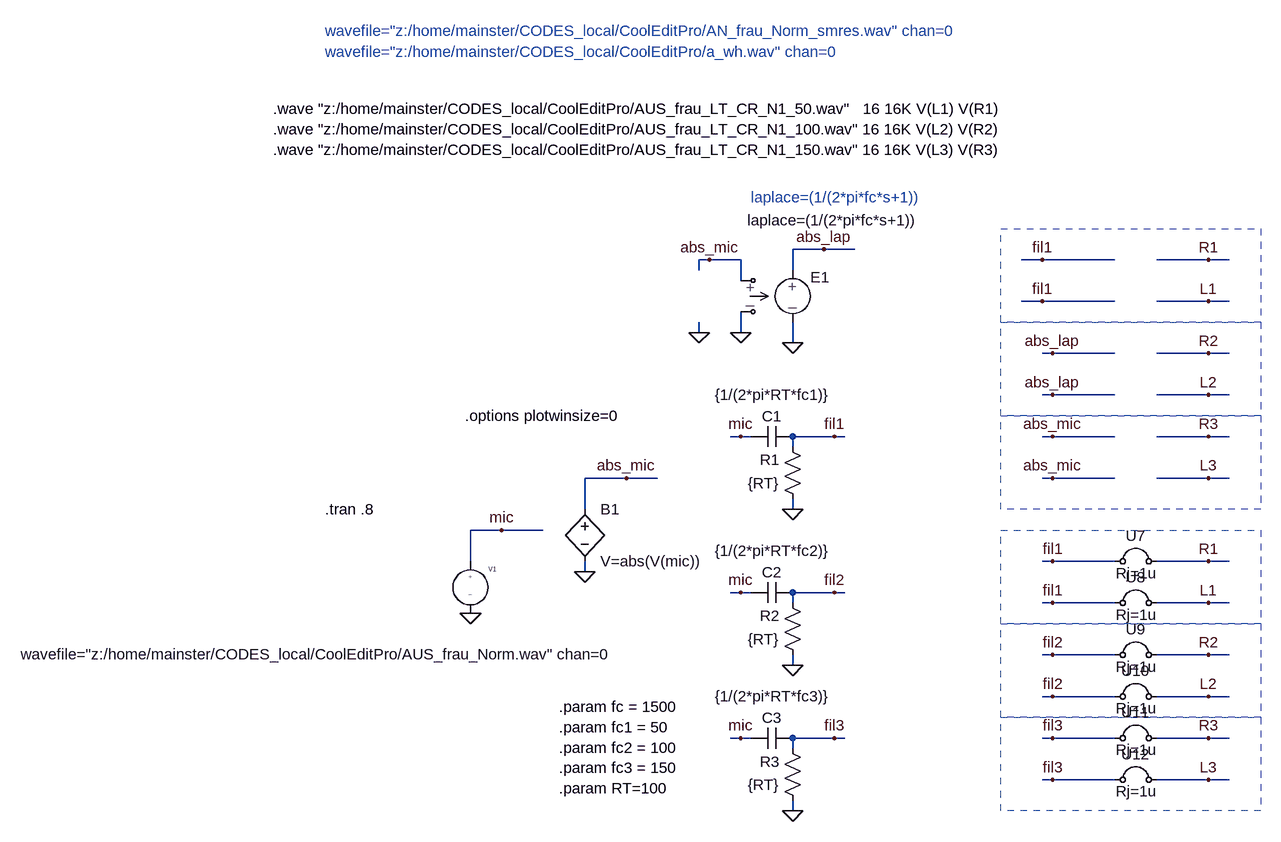
[diagram p0: schematic Grundton_entfernen.asc]
Grundton_entfernen.asc, the LTspice schematic file:
Version 4
SHEET 1 1932 680
WIRE 688 -368 640 -368
WIRE 736 -368 688 -368
WIRE 512 -352 496 -352
WIRE 560 -352 512 -352
WIRE 1024 -352 992 -352
WIRE 1136 -352 1024 -352
WIRE 1280 -352 1200 -352
WIRE 1312 -352 1280 -352
WIRE 496 -336 496 -352
WIRE 640 -336 640 -368
WIRE 560 -320 560 -352
WIRE 1024 -288 992 -288
WIRE 1136 -288 1024 -288
WIRE 1280 -288 1200 -288
WIRE 1312 -288 1280 -288
WIRE 496 -240 496 -256
WIRE 560 -240 560 -272
WIRE 640 -224 640 -256
WIRE 1040 -208 1024 -208
WIRE 1136 -208 1040 -208
WIRE 1280 -208 1200 -208
WIRE 1312 -208 1280 -208
WIRE 1040 -144 1024 -144
WIRE 1136 -144 1040 -144
WIRE 1280 -144 1200 -144
WIRE 1312 -144 1280 -144
WIRE 560 -80 544 -80
WIRE 576 -80 560 -80
WIRE 704 -80 640 -80
WIRE 720 -80 704 -80
WIRE 1040 -80 1024 -80
WIRE 1136 -80 1040 -80
WIRE 1280 -80 1200 -80
WIRE 1312 -80 1280 -80
WIRE 640 -64 640 -80
WIRE 384 -16 320 -16
WIRE 432 -16 384 -16
WIRE 1040 -16 1024 -16
WIRE 1136 -16 1040 -16
WIRE 1280 -16 1200 -16
WIRE 1312 -16 1280 -16
WIRE 320 32 320 -16
WIRE 640 32 640 16
WIRE 192 64 144 64
WIRE 256 64 192 64
WIRE 144 112 144 64
WIRE 1040 112 1024 112
WIRE 1136 112 1040 112
WIRE 1280 112 1200 112
WIRE 1312 112 1280 112
WIRE 320 128 320 112
WIRE 560 160 544 160
WIRE 576 160 560 160
WIRE 704 160 640 160
WIRE 720 160 704 160
WIRE 640 176 640 160
WIRE 1040 176 1024 176
WIRE 1136 176 1040 176
WIRE 1280 176 1200 176
WIRE 1312 176 1280 176
WIRE 1040 256 1024 256
WIRE 1136 256 1040 256
WIRE 1280 256 1200 256
WIRE 1312 256 1280 256
WIRE 640 272 640 256
WIRE 1040 320 1024 320
WIRE 1136 320 1040 320
WIRE 1280 320 1200 320
WIRE 1312 320 1280 320
WIRE 560 384 544 384
WIRE 576 384 560 384
WIRE 704 384 640 384
WIRE 720 384 704 384
WIRE 1040 384 1024 384
WIRE 1136 384 1040 384
WIRE 1280 384 1200 384
WIRE 1312 384 1280 384
WIRE 640 400 640 384
WIRE 1040 448 1024 448
WIRE 1136 448 1040 448
WIRE 1280 448 1200 448
WIRE 1312 448 1280 448
WIRE 640 496 640 480
FLAG 144 192 0
FLAG 192 64 mic
FLAG 320 128 0
FLAG 384 -16 abs_mic
FLAG 640 32 0
FLAG 704 -80 fil1
FLAG 560 -80 mic
FLAG 640 -224 0
FLAG 688 -368 abs_lap
FLAG 560 -240 0
FLAG 512 -352 abs_mic
FLAG 496 -240 0
FLAG 1280 112 R1
FLAG 1280 176 L1
FLAG 1280 256 R2
FLAG 1280 320 L2
FLAG 1280 384 R3
FLAG 1280 448 L3
FLAG 640 272 0
FLAG 704 160 fil2
FLAG 560 160 mic
FLAG 640 496 0
FLAG 704 384 fil3
FLAG 560 384 mic
FLAG 1280 -352 R1
FLAG 1280 -288 L1
FLAG 1280 -208 R2
FLAG 1280 -144 L2
FLAG 1280 -80 R3
FLAG 1280 -16 L3
FLAG 1040 -208 abs_lap
FLAG 1040 -144 abs_lap
FLAG 1040 -80 abs_mic
FLAG 1040 -16 abs_mic
FLAG 1040 112 fil1
FLAG 1040 176 fil1
FLAG 1040 256 fil2
FLAG 1040 320 fil2
FLAG 1040 384 fil3
FLAG 1040 448 fil3
FLAG 1024 -352 fil1
FLAG 1024 -288 fil1
SYMBOL source-V 144 96 R0
WINDOW 3 -692 159 Left 2
SYMATTR Value wavefile="z:/home/mainster/CODES_local/CoolEditPro/AUS_frau_Norm.wav" chan=0
SYMATTR InstName V1
SYMBOL bv 320 16 R0
SYMATTR InstName B1
SYMATTR Value V=abs(V(mic))
SYMBOL res 656 32 R180
WINDOW 0 36 76 Left 2
WINDOW 3 36 40 Left 2
SYMATTR InstName R1
SYMATTR Value {RT}
SYMBOL cap 640 -96 R90
WINDOW 0 0 32 VBottom 2
WINDOW 3 -33 31 VBottom 2
SYMATTR InstName C1
SYMATTR Value {1/(2*pi*RT*fc1)}
SYMBOL crtl-V-V 640 -352 R0
WINDOW 3 -70 -61 Left 2
SYMATTR Value laplace=(1/(2*pi*fc*s+1))
SYMATTR InstName E1
SYMBOL res 656 272 R180
WINDOW 0 36 76 Left 2
WINDOW 3 36 40 Left 2
SYMATTR InstName R2
SYMATTR Value {RT}
SYMBOL cap 640 144 R90
WINDOW 0 0 32 VBottom 2
WINDOW 3 -33 31 VBottom 2
SYMATTR InstName C2
SYMATTR Value {1/(2*pi*RT*fc2)}
SYMBOL res 656 496 R180
WINDOW 0 36 76 Left 2
WINDOW 3 36 40 Left 2
SYMATTR InstName R3
SYMATTR Value {RT}
SYMBOL cap 640 368 R90
WINDOW 0 0 32 VBottom 2
WINDOW 3 -33 31 VBottom 2
SYMATTR InstName C3
SYMATTR Value {1/(2*pi*RT*fc3)}
SYMBOL MDB_sym\\jumperRes 1168 48 R0
SYMATTR InstName U7
SYMBOL MDB_sym\\jumperRes 1168 112 R0
SYMATTR InstName U8
SYMBOL MDB_sym\\jumperRes 1168 192 R0
SYMATTR InstName U9
SYMBOL MDB_sym\\jumperRes 1168 256 R0
SYMATTR InstName U10
SYMBOL MDB_sym\\jumperRes 1168 320 R0
SYMATTR InstName U11
SYMBOL MDB_sym\\jumperRes 1168 384 R0
SYMATTR InstName U12
TEXT 136 -112 Left 2 !.options plotwinsize=0
TEXT -80 -672 Left 2 ;wavefile="z:/home/mainster/CODES_local/CoolEditPro/a_wh.wav" chan=0
TEXT -80 -704 Left 2 ;wavefile="z:/home/mainster/CODES_local/CoolEditPro/AN_frau_Norm_smres.wav" chan=0
TEXT 280 336 Left 2 !.param fc = 1500\n.param fc1 = 50\n.param fc2 = 100\n.param fc3 = 150\n.param RT=100
TEXT -80 32 Left 2 !.tran .8
TEXT -160 -584 Left 2 !.wave "z:/home/mainster/CODES_local/CoolEditPro/AUS_frau_LT_CR_N1_50.wav"   16 16K V(L1) V(R1)\n.wave "z:/home/mainster/CODES_local/CoolEditPro/AUS_frau_LT_CR_N1_100.wav" 16 16K V(L2) V(R2)\n.wave "z:/home/mainster/CODES_local/CoolEditPro/AUS_frau_LT_CR_N1_150.wav" 16 16K V(L3) V(R3)
TEXT 576 -448 Left 2 ;laplace=(1/(2*pi*fc*s+1))
RECTANGLE Normal 1360 208 960 64 2
RECTANGLE Normal 1360 352 960 208 2
RECTANGLE Normal 1360 496 960 352 2
RECTANGLE Normal 1360 -256 960 -400 2
RECTANGLE Normal 1360 -112 960 -256 2
RECTANGLE Normal 1360 32 960 -112 2

The netlist it stands for:
* Grundton_entfernen.asc
V1 mic 0 wavefile="z:/home/mainster/CODES_local/CoolEditPro/AUS_frau_Norm.wav" chan=0
B1 abs_mic 0 V=abs(V(mic))
R1 0 fil1 {RT}
C1 fil1 mic {1/(2*pi*RT*fc1)}
E1 abs_lap 0 abs_mic 0 laplace=(1/(2*pi*fc*s+1))
R2 0 fil2 {RT}
C2 fil2 mic {1/(2*pi*RT*fc2)}
R3 0 fil3 {RT}
C3 fil3 mic {1/(2*pi*RT*fc3)}
XU7 fil1 R1 jumperResistor Rin=1t Rout=1t Rj=1u  ; pins + -
XU8 fil1 L1 jumperResistor Rin=1t Rout=1t Rj=1u  ; pins + -
XU9 fil2 R2 jumperResistor Rin=1t Rout=1t Rj=1u  ; pins + -
XU10 fil2 L2 jumperResistor Rin=1t Rout=1t Rj=1u  ; pins + -
XU11 fil3 R3 jumperResistor Rin=1t Rout=1t Rj=1u  ; pins + -
XU12 fil3 L3 jumperResistor Rin=1t Rout=1t Rj=1u  ; pins + -
.options plotwinsize=0
* wavefile="z:/home/mainster/CODES_local/CoolEditPro/a_wh.wav" chan=0
* wavefile="z:/home/mainster/CODES_local/CoolEditPro/AN_frau_Norm_smres.wav" chan=0
.param fc = 1500
.param fc1 = 50
.param fc2 = 100
.param fc3 = 150
.param RT=100
.tran .8
.wave "z:/home/mainster/CODES_local/CoolEditPro/AUS_frau_LT_CR_N1_50.wav"   16 16K V(L1) V(R1)
.wave "z:/home/mainster/CODES_local/CoolEditPro/AUS_frau_LT_CR_N1_100.wav" 16 16K V(L2) V(R2)
.wave "z:/home/mainster/CODES_local/CoolEditPro/AUS_frau_LT_CR_N1_150.wav" 16 16K V(L3) V(R3)
* laplace=(1/(2*pi*fc*s+1))
.lib MDB_sub/jumperRes.sub
.backanno
.end